# Altium schematic sheet IGBT_C.SchDoc: IGBT C
size A4; DrawnBy: Jarod Krane; Organization: Altium Limited; Address1: L3, 12a Rodborough Rd; Address2: Frenchs Forest; Address3: NSW; Address4: Australia 2086; Revision: 0; SheetNumber: 7; SheetTotal: 11
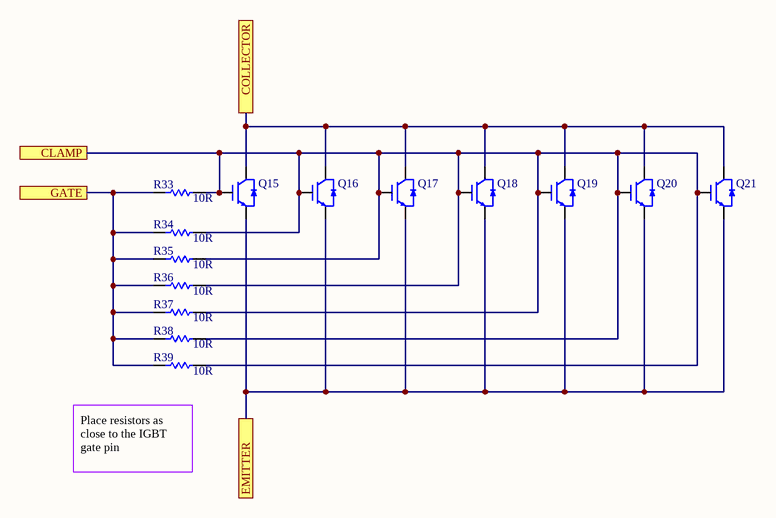
[diagram p0: IGBT_C.SchDoc]

## Parts
Q15  STGB30V60DF  [DPAK2_IGBT]  (value not drawn)
Q16  STGB30V60DF  [DPAK2_IGBT]  (value not drawn)
Q17  STGB30V60DF  [DPAK2_IGBT]  (value not drawn)
Q18  STGB30V60DF  [DPAK2_IGBT]  (value not drawn)
Q19  STGB30V60DF  [DPAK2_IGBT]  (value not drawn)
Q20  STGB30V60DF  [DPAK2_IGBT]  (value not drawn)
Q21  STGB30V60DF  [DPAK2_IGBT]  (value not drawn)
R33  10R  [RES-0603]
R34  10R  [RES-0603]
R35  10R  [RES-0603]
R36  10R  [RES-0603]
R37  10R  [RES-0603]
R38  10R  [RES-0603]
R39  10R  [RES-0603]

## Ports
CLAMP, COLLECTOR, EMITTER, GATE

## Nets
CLAMP: Q15.1 Q16.1 Q17.1 Q18.1 Q19.1 Q20.1 Q21.1 R33.2 R34.2 R35.2 R36.2 R37.2 R38.2 R39.2 ; port CLAMP
COLLECTOR: Q15.2 Q16.2 Q17.2 Q18.2 Q19.2 Q20.2 Q21.2 ; port COLLECTOR
EMITTER: Q15.3 Q16.3 Q17.3 Q18.3 Q19.3 Q20.3 Q21.3 ; port EMITTER
GATE: R33.1 R34.1 R35.1 R36.1 R37.1 R38.1 R39.1 ; port GATE

## Notes on the sheet
- (near R39) Place resistors as close to the IGBT gate pin
- Title
- Size:
- Date:
- A4
- Number:
- Time:
- Revision:
- Sheet
- of
- File:

## Library data of the parts
Q15-Q21 = STGB30V60DF: IGBT 600V 60A 258W D2PAK; Manufacturer: STMicroelectronics; Reverse Recovery Time: 53ns; Element Configuration: Single; Collector Emitter Saturation Voltage: 1.85V; Supplier 1: Digi-Key; Manufacturer Part Number: STGB30V60DF; Stock 1: 916; Pricing 1: 1=2.43, 10=2.015, 25=1.9496, 100=1.604, 500=1.358 (USD); Mount: Surface Mount; Case/Package: TO-263-3; Weight: 0.079014oz; Min Operating Temperature: -55°C; Max Operating Temperature: 175°C; Packaging: Tape and Reel; Collector Emitter Voltage (VCEO): 600V; Max Collector Current: 60A; Max Power Dissipation: 258W; Collector Emitter Breakdown Voltage: 600V; Max Breakdown Voltage: 600V; Package Quantity: 1000; RoHS Compliant: Yes; ComponentLink1URL: http://www.st.com/content/ccc/resource/technical/document/datasheet/14/ad/1c/bd/db/a9/4a/fc/DM00079435.pdf/files/DM00079435.pdf/jcr:content/translations/en.DM00079435.pdf?src-supplier=Digi-Key; ComponentLink1Description: http://www.st.com/content/ccc/resource/technical/document/datasheet/14/ad/1c/bd/db/a9/4a/fc/DM00079435.pdf/files/DM00079435.pdf/jcr:content/translations/en.DM00079435.pdf?src-supplier=Digi-Key; ComponentLink2URL: http://www.mouser.com/ds/2/389/stgb30v60df-956007.pdf?src-supplier=Mouser; ComponentLink2Description: http://www.mouser.com/ds/2/389/stgb30v60df-956007.pdf?src-supplier=Mouser; ComponentLink3URL: http://www.st.com/st-web-ui/static/active/en/resource/technical/document/datasheet/DM00079435.pdf?src-supplier=Avnet; ComponentLink3Description: http://www.st.com/st-web-ui/static/active/en/resource/technical/document/datasheet/DM00079435.pdf?src-supplier=Avnet; ComponentLink4URL: http://components.arrow.com/part/dataview/0323_06933392?src-supplier=Arrow+Europe; ComponentLink4Description: http://components.arrow.com/part/dataview/0323_06933392?src-supplier=Arrow+Europe; Supplier Part Number 1: 497-15120-6-ND
R33-R39 = 0603-10R: RES SMD 10 OHM 1% 1/10W 0603; Manufacturer: Yageo; Manufacturer Part Number: RC0603FR-0710RL; Voltage Rating (DC): 50V; Temperature Coefficient: 200ppm/°C; Power Rating: 100mW; Supplier 1: Digi-Key; Stock 1: 11151092; Pricing 1: 1=0.1, 10=0.046, 100=0.0187, 1000=0.0084, 2500=0.00729 (USD); Case/Package: 0603; Number of Pins: 2; Case Code (Imperial): 0603; Case Code (Metric): 1608; Contact Plating: Tin,Matte; Min Operating Temperature: -55°C; Max Operating Temperature: 155°C; Packaging: Tape and Reel; Resistance: 10R; Tolerance: 1%; Composition: Thick Film; Voltage Rating: 50V; Termination: SMD/SMT; Military Standard: Not; Length: 1.6mm; Height: 0.45mm; Width: 0.8mm; Depth: 0.8mm; Radiation Hardening: No; REACH SVHC: No SVHC; Lead Free: Lead Free; ComponentLink1URL: http://www.farnell.com/datasheets/1868787.pdf?src-supplier=Element14; ComponentLink1Description: http://www.farnell.com/datasheets/1868787.pdf?src-supplier=Element14; ComponentLink2URL: http://www.yageo.com/documents/recent/PYu-RC0603_51_RoHS_L_4.pdf?src-supplier=Avnet; ComponentLink2Description: http://www.yageo.com/documents/recent/PYu-RC0603_51_RoHS_L_4.pdf?src-supplier=Avnet; ComponentLink3URL: http://documents.rs-components.com/techlib://itc_doclist_GB.htm?stockno=5048984&src-supplier=RSComponents; ComponentLink3Description: http://documents.rs-components.com/techlib://itc_doclist_GB.htm?stockno=5048984&src-supplier=RSComponents; ComponentLink4URL: http://www.yageo.com/documents/recent/PYu-RC0603_51_RoHS_L_4.pdf?src-supplier=Avnet+Europe; ComponentLink4Description: http://www.yageo.com/documents/recent/PYu-RC0603_51_RoHS_L_4.pdf?src-supplier=Avnet+Europe; Supplier Part Number 1: 311-10.0HRDKR-ND